# EAGLE design diode_sampling_gate_4D (EAGLE 9.2.2)
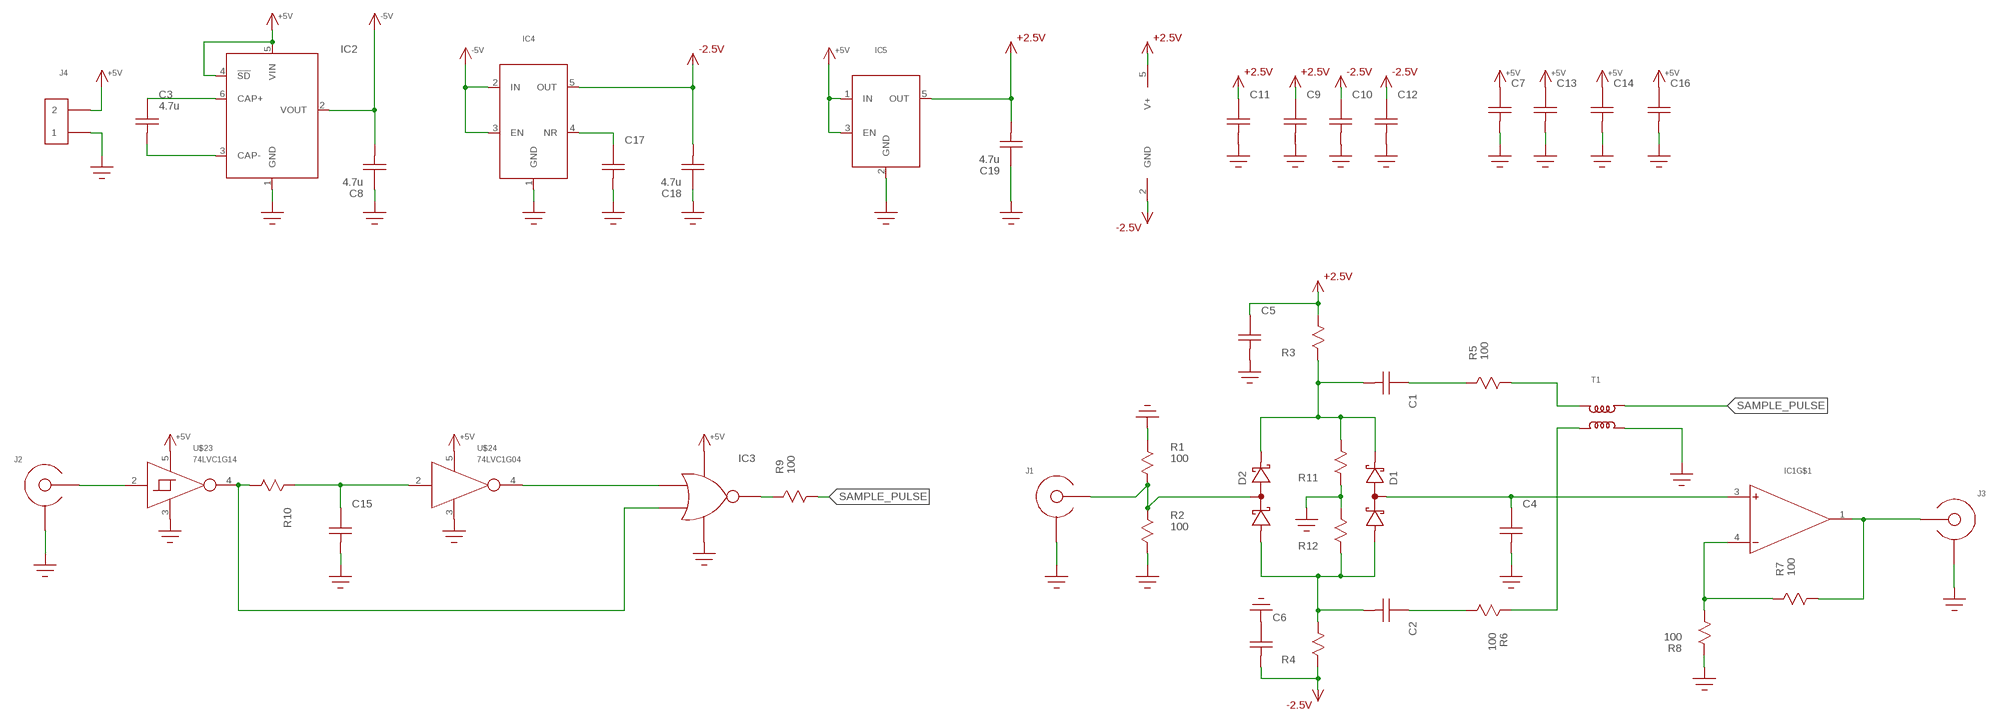
[diagram p0: schematic, sheet 1]

## Parts
C1  C0603  [C0603]
C2  C0603  [C0603]
C3  4.7u  C0805  [0805]
C4  C0603  [C0603]
C5  C0603  [C0603]
C6  C0603  [C0603]
C7  C0603  [C0603]
C8  4.7u  C0805  [0805]
C9  C0603  [C0603]
C10  C0603  [C0603]
C11  C0805  [0805]
C12  C0805  [0805]
C13  C0603  [C0603]
C14  C0603  [C0603]
C15  C0603  [C0603]
C16  C0805  [0805]
C17  C0603  [C0603]
C18  4.7u  C0805  [0805]
C19  4.7u  C0805  [0805]
D1  BAS40-04  [SOT-23]
D2  BAS40-04  [SOT-23]
IC1  MCP6V81  [SOT23-5]
IC2  LM2664  [SOT23-6]
IC3  74LVC1G02  [SOT23-5]
IC4  TPS723XX  [SOT23-5]
IC5  LP5907  [SOT23-5]
J1  EDGE_LAUNCH_JACK  [EDGE_LAUNCH_RF_CON]
J2  EDGE_LAUNCH_JACK  [EDGE_LAUNCH_RF_CON]
J3  EDGE_LAUNCH_JACK  [EDGE_LAUNCH_RF_CON]
J4  HEADER_2PIN  [HEADER_2PIN]
R1  100  R0603  [R0603]
R2  100  R0603  [R0603]
R3  R0603  [R0603]
R4  R0603  [R0603]
R5  100  R0603  [R0603]
R6  100  R0603  [R0603]
R7  100  R0603  [R0603]
R8  100  R0603  [R0603]
R9  100  R0603  [R0603]
R10  R0603  [R0603]
R11  R0603  [R0603]
R12  R0603  [R0603]
T1  MABA007159  [MABAES0061]
U$23  74LVC1G14  [SOT23-5]
U$24  74LVC1G04  [SOT23-5]

## Nets
+2.5V: C5.P$2 C9.P$2 C11.P$2 C19.P$1 IC1.5(V+) IC5.5(OUT) R3.P$2
+5V: C7.P$2 C13.P$2 C14.P$2 C16.P$2 IC2.4(!SD!) IC2.5(VIN) IC3.5(VCC) IC5.1(IN) IC5.3(EN) J4.2 U$23.5(VCC) U$24.5(VCC)
-2.5V: C6.P$1 C10.P$2 C12.P$2 C18.P$1 IC1.2(GND) IC4.5(OUT) R4.P$1
-5V: C8.P$1 IC2.2(VOUT) IC4.2(IN) IC4.3(EN)
GND: C4.P$1 C5.P$1 C6.P$2 C7.P$1 C8.P$2 C9.P$1 C10.P$1 C11.P$1 C12.P$1 C13.P$1 C14.P$1 C15.P$1 C16.P$1 C17.P$1 C18.P$2 C19.P$2 IC2.1(GND) IC3.3(GND) IC4.1(GND) IC5.2(GND) J1.GND@1(SHIELD) J1.GND@2(SHIELD) J1.GND@3(SHIELD) J1.GND@4(SHIELD) J1.GND@5(SHIELD) J1.GND@6(SHIELD) J1.GND@7(SHIELD) J1.GND@8(SHIELD) J1.GND@9(SHIELD) J1.GND@10(SHIELD) J1.GND@11(SHIELD) J1.GND@12(SHIELD) J1.SHIELD@1(SHIELD) J1.SHIELD@2(SHIELD) J2.GND@1(SHIELD) J2.GND@2(SHIELD) J2.GND@3(SHIELD) J2.GND@4(SHIELD) J2.GND@5(SHIELD) J2.GND@6(SHIELD) J2.GND@7(SHIELD) J2.GND@8(SHIELD) J2.GND@9(SHIELD) J2.GND@10(SHIELD) J2.GND@11(SHIELD) J2.GND@12(SHIELD) J2.SHIELD@1(SHIELD) J2.SHIELD@2(SHIELD) J3.GND@1(SHIELD) J3.GND@2(SHIELD) J3.GND@3(SHIELD) J3.GND@4(SHIELD) J3.GND@5(SHIELD) J3.GND@6(SHIELD) J3.GND@7(SHIELD) J3.GND@8(SHIELD) J3.GND@9(SHIELD) J3.GND@10(SHIELD) J3.GND@11(SHIELD) J3.GND@12(SHIELD) J3.SHIELD@1(SHIELD) J3.SHIELD@2(SHIELD) J4.1 R1.P$1 R2.P$2 R8.P$1 R11.P$1 R12.P$2 T1.3 U$23.3(GND) U$24.3(GND)
N$1: D2.3(COMMON) J1.CENTER R1.P$2 R2.P$1
N$2: C1.P$2 R5.P$1
N$3: C1.P$1 D1.2(CATHODE) D2.2(CATHODE) R3.P$1 R11.P$2
N$4: IC3.2(B) R10.P$2 U$23.4(OUT)
N$5: C2.P$1 D1.1(ANODE) D2.1(ANODE) R4.P$2 R12.P$1
N$6: IC1.4(-) R7.P$1 R8.P$2
N$7: IC1.1(OUT) J3.CENTER R7.P$2
N$8: IC3.1(A) U$24.4(OUT)
N$9: C2.P$2 R6.P$2
N$10: C4.P$2 D1.3(COMMON) IC1.3(+)
N$11: R5.P$2 T1.5
N$12: R6.P$1 T1.4
N$13: C17.P$2 IC4.4(NR)
N$14: C15.P$2 R10.P$1 U$24.2(IN)
N$15: IC3.4(Y) R9.P$1
N$16: J2.CENTER U$23.2(IN)
N$18: C3.P$2 IC2.6(CAP+)
N$19: C3.P$1 IC2.3(CAP-)
SAMPLE_PULSE: R9.P$2 T1.1

## Library data of the parts
C1-C19 = yapo:C
D1 D2 = yapo:BAS40-04
IC1 = yapo:MCP6V81
IC2 = yapo:LM2664
IC3 = yapo:74LVC1G02
IC4 = yapo:TPS723XX
IC5 = yapo:LP5907
J1-J3 = yapo:EDGE_LAUNCH_JACK
J4 = yapo:HEADER_2PIN
R1-R12 = yapo:R
T1 = yapo:MABA007159
U$23 = yapo:74LVC1G14
U$24 = yapo:74LVC1G04

## Board
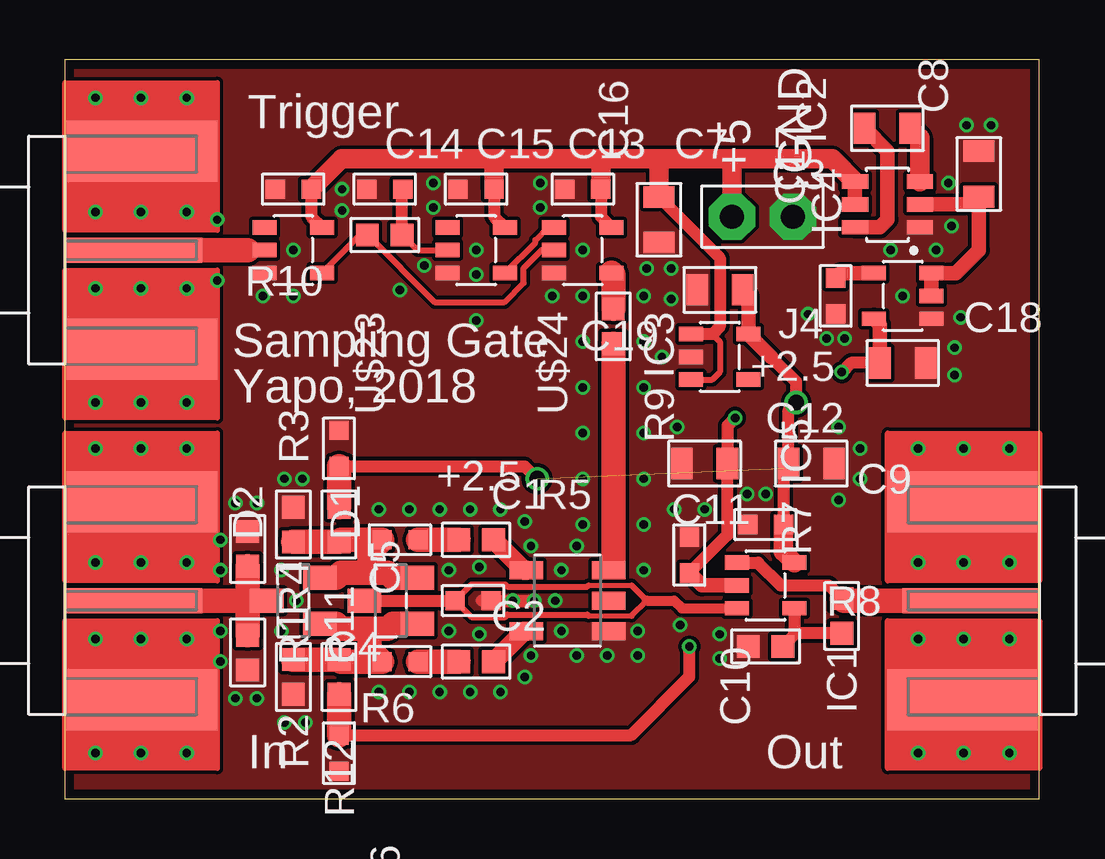
[diagram p1: board, top side]
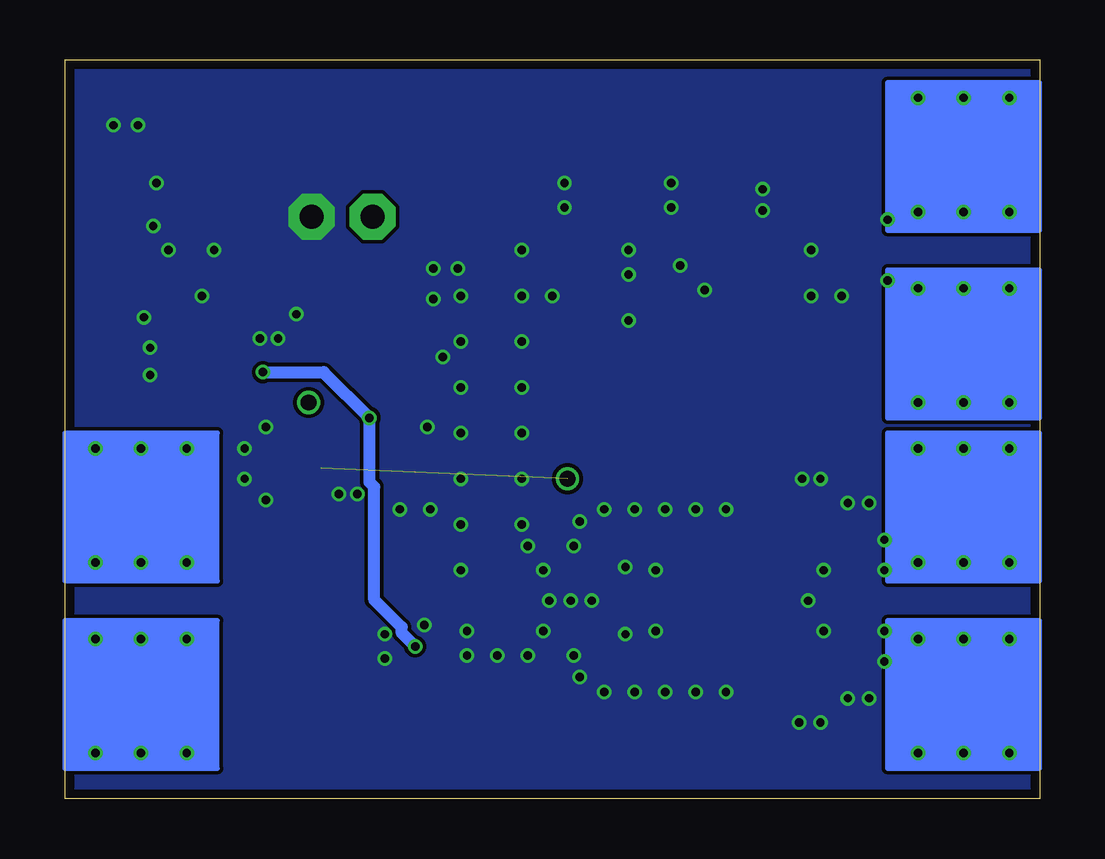
[diagram p2: board, bottom side, seen from below]

Size 40.62 x 30.79 mm. Coordinates in mm from the lower left corner, seen from the top.
Outline: 0,0 40.62,0 40.62,30.79 0,30.79 0,0
Copper layers (1*16): Top 0.035559375mm / dielectric 1.6mm / Bottom 0.035559375mm
Design rules "oshpark-2layer *": minimum track width 6mil, minimum drill 10mil, track to track 6mil, track to pad 6mil, pad to pad 6mil, via to via 6mil, smd to smd 6mil, copper to edge 15mil, drill to drill 6mil, minimum pad ring 5mil, minimum via ring 5mil, stop-mask expansion 2.5mil, vias tented up to drill 20mil, thermal gap 10mil

### Footprints (pad centres in the part's own frame; a part is rotated, then mirrored left to right if it is on the bottom)
C0603 = smd 0.8 x 0.8: P$1 -0.75,0; P$2 0.75,0
0805 = smd 0.9 x 1.3: P$1 -0.95,0; P$2 0.95,0
SOT-23 = smd 1 x 1.4: 1 -0.95,-1.1; 2 0.95,-1.1; 3 0,1.1
SOT23-5 = smd 0.6 x 1: 1 -0.95,-1.2; 2 0,-1.2; 3 0.95,-1.2; 4 0.95,1.2; 5 -0.95,1.2
SOT23-6 = smd 0.6 x 1.1: 1 -0.95,-1.35; 2 0,-1.35; 3 0.95,-1.35; 4 0.95,1.35; 5 0,1.35; 6 -0.95,1.35
EDGE_LAUNCH_RF_CON = smd 5.715 x 1.041: CENTER -2.875,0 | drill 0.35: GND@1 -5.08,1.587; GND@2 -3.175,1.587; GND@3 -1.27,1.587; GND@4 -5.08,-1.587; GND@5 -3.175,-1.587; GND@6 -1.27,-1.587; GND@7 -5.08,6.35; GND@8 -3.175,6.35; GND@9 -1.27,6.35; GND@10 -5.08,-6.35; GND@11 -3.175,-6.35; GND@12 -1.27,-6.35 | smd 6.35 x 2.54: SHIELD@1 -3.175,-4.128; SHIELD@2 -3.175,4.128
HEADER_2PIN = drill 1 pad 1.93 octagon: 1 -1.27,0; 2 1.27,0
R0603 = smd 0.95 x 0.95: P$1 -0.725,0; P$2 0.725,0
MABAES0061 = smd 0.76 x 1.4: 1 1.27,-1.715; 2 0,-1.715; 3 -1.27,-1.715; 4 -1.27,1.715; 5 1.27,1.715

### Placement (x,y rotation side)
C1  13.97,10.79 0 top
C2  13.97,5.71 0 top
C3  34.29,27.94 180 top
C4  17.02,8.26 180 top
C5  11.43,14.61 270 top
C6  11.43,1.91 270 top
C7  21.59,25.4 0 top
C8  38.1,26.04 90 top
C9  29.21,11.43 0 top
C10  26.04,10.16 270 top
C11  31.11,13.97 180 top
C12  26.67,13.97 0 top
C13  17.14,25.4 0 top
C14  9.53,25.4 0 top
C15  13.34,25.4 0 top
C16  24.77,24.13 90 top
C17  32.13,20.95 90 top
C18  34.92,18.16 0 top
C19  27.3,21.21 180 top
D1  13.59,8.26 90 top
D2  9.53,8.26 90 top
IC1  29.21,8.89 270 top
IC2  34.29,24.77 90 top
IC3  21.59,22.86 270 top
IC4  34.92,20.95 90 top
IC5  27.3,18.41 270 top
J1  0,8.26 180 top
J2  0,22.86 180 top
J3  40.64,8.26 0 top
J4  29.08,24.26 180 top
R1  7.62,10.41 270 top
R2  7.62,6.1 270 top
R3  11.43,11.43 90 top
R4  11.43,5.08 90 top
R5  17.14,10.79 0 top
R6  17.14,5.71 180 top
R7  32.38,7.62 90 top
R8  29.21,6.35 0 top
R9  22.86,19.68 270 top
R10  13.34,23.5 180 top
R11  9.53,11.43 270 top
R12  9.53,5.08 270 top
T1  20.95,8.26 90 top
U$23  9.53,22.86 270 top
U$24  17.14,22.86 270 top

### Tracks (layer width: path | path; a pad name or v marks a point on that pad's centre or on a via)
+2.5V  (via drill 0.65)  (1 unrouted)
  Top 0.508: 29.96,10.79 29.96,13.77 C11.P$2 30.16,16.2 v30.48,16.51 30.48,17.39 29.46,18.41 | C5.P$2 19.16,13.86 v19.68,13.34
  Top 0.61: 29.46,18.41 IC5.5 28.5,20.96 C19.P$1
  Top 0.813: C9.P$2 29.96,10.79 29.96,10.29 IC1.5
  Top 1.016: C5.P$2 R3.P$2
+5V
  Top 0.254: IC5.3 26.99,17.46 27.3,17.78 27.3,19.05 26.99,19.36 26.67,19.36 IC5.1
  Top 0.508: C14.P$2 10.28,24.26 U$23.5 | C13.P$2 17.89,24.26 U$24.5 | C7.P$2 22.34,24.26 IC3.5 | C16.P$2 27.3,22.54 27.3,19.68 26.98,19.36 26.67,19.36
  Top 0.61: IC2.4 IC2.5
  Top 0.813: C14.P$2 11.54,26.67 17.78,26.67 | 17.78,26.67 22.23,26.67 | 24.77,26.67 C16.P$2 | C7.P$2 22.34,26.55 22.23,26.67 | C13.P$2 17.89,26.55 17.78,26.67 | 22.23,26.67 24.77,26.67 | 24.77,26.67 27.94,26.67 | 27.94,26.67 31.98,26.67 IC2.4 | J4.2 27.81,26.54 27.94,26.67
-2.5V  (via drill 0.35)
  Top 0.508: C10.P$2 27.62,10.99 C12.P$2 27.62,15.55 v27.94,15.88 | C6.P$1 23.61,2.65 26.04,5.08 v26.04,6.35 | C18.P$1 32.77,18.16 v32.38,17.78
  Top 0.61: C10.P$2 26.55,8.89 IC1.2 | IC4.5 33.98,19.75 C18.P$1
  Top 1.016: C6.P$1 R4.P$1
  Bottom 0.508: v26.04,6.35 26.6,6.91 26.6,7.15 27.74,8.29 27.74,12.99 27.94,13.19 v27.94,15.88 29.84,17.78 v32.38,17.78
-5V
  Top 0.61: IC2.2 37.78,24.77 C8.P$1 38.1,22.86 37.15,21.91 IC4.3 IC4.2
GND  (via drill 0.35)
  Top 0.508: 17.39,8.26 v18.67,8.26 v19.56,8.26
  other vias: 21.59,17.14 21.59,19.05 21.59,20.95 24.13,17.14 24.13,15.24 24.13,19.05 24.13,20.95 11.56,25.4 15.37,25.65 19.81,25.65 17.14,22.86 9.53,22.86 21.59,22.86 20.32,20.95 17.14,21.84 14.99,22.23 9.53,20.95 8.26,20.95 6.35,21.59 6.35,24.13 15.37,24.64 19.81,24.64 11.56,24.51 17.14,19.94 13.97,21.21 9.65,8.26 7.11,12.32 8,12.32 7.11,4.19 8,4.19 6.48,6.99 6.48,9.53 6.48,10.79 6.48,5.71 9.14,13.34 9.91,13.34 9.14,3.17 10.03,3.17 13.08,12.06 14.35,12.06 15.62,12.06 16.89,12.06 18.16,12.06 19.43,10.54 20.7,9.53 21.34,10.54 13.08,4.45 14.35,4.45 15.62,4.45 16.89,4.45 18.16,4.45 19.43,5.97 20.7,6.99 21.34,5.97 9.02,9.53 9.02,6.99 16,9.53 16,6.99 17.27,9.65 17.27,6.86 21.59,15.24 21.59,13.34 21.59,11.43 24.13,11.43 24.13,13.34 24.13,9.53 22.61,5.97 23.88,5.97 23.88,6.99 20.45,8.26 19.18,11.56 19.18,5.08 25.4,12.06 26.67,12.06 25.53,15.49 32.26,15.49 33.15,14.61 33.15,13.34 27.3,6.86 27.3,5.84 28.45,12.7 29.21,12.7 32.26,12.45 25.65,7.24 36.96,23.88 36.32,22.86 37.59,28.07 38.61,28.07 31.75,19.18 32.51,19.18 34.92,20.95 37.34,20.07 37.08,18.8 37.08,17.65 34.42,22.86 36.83,25.65 24.26,22.1 25.27,22.1 25.27,20.83 24.89,18.41 30.99,20.19
  pour Bottom (no thermals): 0,0 40.64,0 40.64,31.11 0,31.11
  pour Top (no thermals): 0,0 40.64,0 40.64,31.11 0,31.11
N$1
  Top 1.016: J1.CENTER 7.62,8.26 | 7.62,8.26 D2.3 | R1.P$2 7.62,8.26 | R2.P$1 7.62,8.26
N$2
  Top 1.016: C1.P$2 R5.P$1
N$3
  Top 1.016: R11.P$2 R3.P$1 11.52,10.79 C1.P$1 12.7,10.28 12.7,9.41 | D2.2 11.3,9.21 11.52,9.41 12.7,9.41 | 12.7,9.41 13.46,9.41 13.67,9.21 D1.2
N$4
  Top 0.254: IC3.2 19.87,22.86 19.12,22.11 19.12,21.49 18.33,20.7 15.41,20.7 R10.P$2 12.31,23.5 U$23.4
N$5
  Top 1.016: D2.1 11.3,7.3 11.52,7.09 12.7,7.09 | 12.7,7.09 13.46,7.09 13.67,7.3 D1.1 | R12.P$1 R4.P$2 11.52,5.71 C2.P$1 12.7,6.24 12.7,7.09
N$6
  Top 0.508: R7.P$1 30.48,6.89 | 30.48,6.89 R8.P$2 | IC1.4 30.41,6.96 30.48,6.89
N$7
  Top 0.508: IC1.1 28.89,9.84 29.84,8.89 31.84,8.89 R7.P$2
  Top 1.016: J3.CENTER 32.48,8.26 R7.P$2
N$8
  Top 0.254: U$24.4 19.61,23.18 19.61,23.28 20.14,23.81 IC3.1
N$9
  Top 1.016: C2.P$2 R6.P$2
N$10
  Top 0.203: 21.83,8.89 23.62,8.89 | 21.83,7.62 23.62,7.62
  Top 0.254: 21.83,8.89 21.78,8.84 18.45,8.84 18.36,8.93 16.95,8.93 C4.P$2 16.95,7.58 18.36,7.58 18.45,7.67 21.78,7.67 21.83,7.62 | 23.62,8.89 24.26,8.26 23.62,7.62
  Top 0.406: 24.26,8.26 25.4,8.26 25.71,7.94 IC1.3
  Top 0.508: D1.3 C4.P$2
N$11
  Top 0.813: R5.P$2 19.14,9.53 T1.5
N$12
  Top 0.813: R6.P$1 19.14,6.99 T1.4
N$13
  Top 0.61: IC4.4 32.33,21.91 C17.P$2
N$14
  Top 0.254: R10.P$1 14.7,22.86 U$24.2
  Top 0.508: R10.P$1 14.06,25.38 C15.P$2
N$15
  Top 1.016: IC3.4 22.86,21.84 R9.P$1
N$16
  Top 0.508: 7.62,22.86 U$23.2
  Top 1.016: J2.CENTER 7.62,22.86
N$18
  Top 0.61: IC2.6 33.98,23.82 34.29,24.13 34.29,26.99 C3.P$2
N$19
  Top 0.813: C3.P$1 35.64,27.54 IC2.3
SAMPLE_PULSE
  Top 0.508: T1.1 22.86,9.71
  Top 1.016: 22.86,9.71 R9.P$2

### Text on the board
tPlace: Trigger | +5 | GND | Sampling Gate | Yapo, 2018 | +2.5 | +2.5 | In | Out